# EAGLE design DisplayAddOn_V012 (EAGLE 9.1.0)
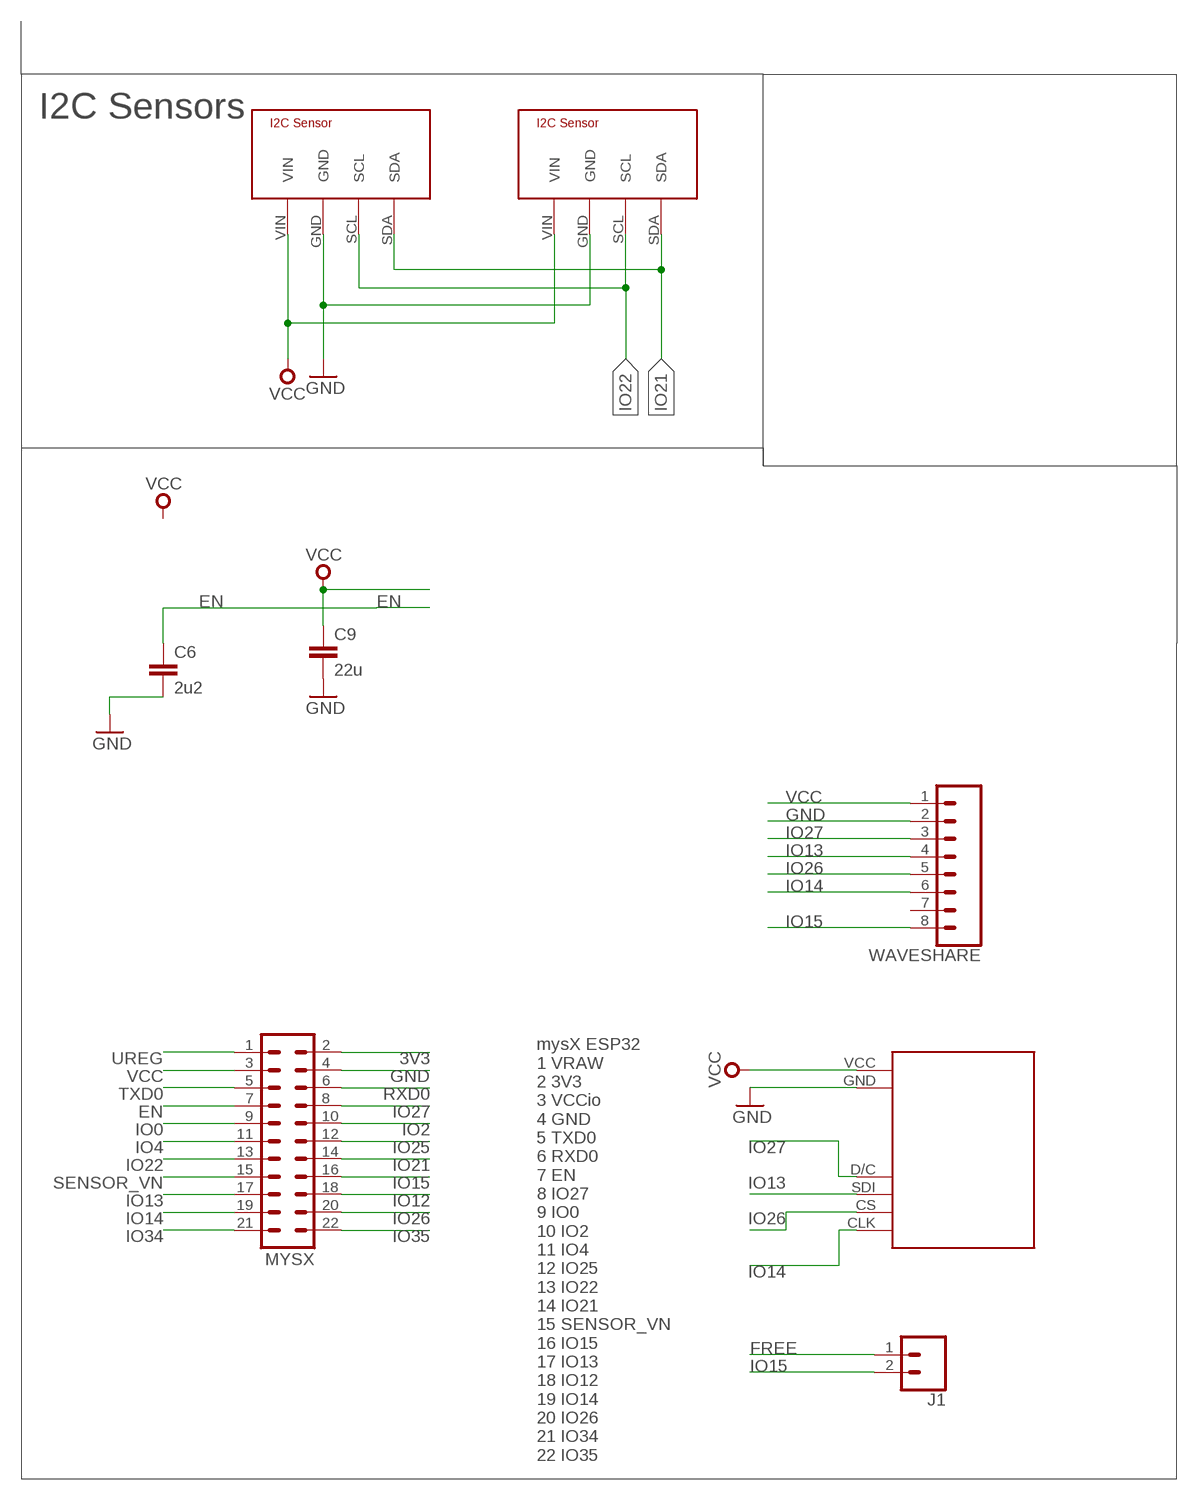
[diagram p0: schematic, sheet 1]

## Parts
C6  2u2  C-EUC0805  [C0805]
C9  22u  C-EUC0805  [C0805]
HELTEK  HELTEC_1.54STANDARD1  [HELTEC_1.54INCH]
J1  CONN_02  [1X02]
MYSX  MA11-2  [MA11-2]
U$2  I2C-BREAKOUT  [I2C_BREAKOUT]
U$4  I2C-BREAKOUT  [I2C_BREAKOUT]
WAVESHARE  CONN_08"  [1X08]

## Nets
3V3: MYSX.2
EN: C6.1 MYSX.7
FREE: J1.1
GND [gnd]: C6.2 C9.2 HELTEK.GND MYSX.4 U$2.GND U$4.GND WAVESHARE.2
IO0: MYSX.9
IO2: MYSX.10
IO4: MYSX.11
IO12: MYSX.18
IO13: HELTEK.SDI MYSX.17 WAVESHARE.4
IO14: HELTEK.CLK MYSX.19 WAVESHARE.6
IO15: J1.2 MYSX.16 WAVESHARE.8
IO21: MYSX.14 U$2.SDA U$4.SDA
IO22: MYSX.13 U$2.SCL U$4.SCL
IO25: MYSX.12
IO26: HELTEK.CS MYSX.20 WAVESHARE.5
IO27: HELTEK.D/C MYSX.8 WAVESHARE.3
IO34: MYSX.21
IO35: MYSX.22
RXD0: MYSX.6
SENSOR_VN: MYSX.15
TXD0: MYSX.5
UREG [gnd]: MYSX.1
VCC [gnd]: C9.1 HELTEK.VCC MYSX.3 U$2.VIN U$4.VIN WAVESHARE.1
Unconnected: WAVESHARE.7

## Notes on the sheet
- I2C Sensors
- mysX ESP32
  1 VRAW
  2 3V3
  3 VCCio
  4 GND
  5 TXD0
  6 RXD0
  7 EN
  8 IO27
  9 IO0
  10 IO2
  11 IO4
  12 IO25
  13 IO22
  14 IO21
  15 SENSOR_VN
  16 IO15
  17 IO13
  18 IO12
  19 IO14
  20 IO26
  21 IO34
  22 IO35

## Library data of the parts
C6 C9 = rcl@1:C-EU: CAPACITOR, European symbol; SPICEPREFIX: C
HELTEK = display_v2:HELTEC_1.54
J1 = SparkFun-Connectors:CONN_02: Multi connection point. Often used as Generic Header-pin footprint for 0.1 inch spaced/style header connections On any of the 0.1 inch spaced packages, you can populate with these: Break Away Headers - Straight <https://www.sparkfun.com/products/116> (PRT-00116) Break Away Male Headers - Right Angle <https://www.sparkfun.com/products/553> (PRT-00553) Female Headers <https://www.sparkfun.com/products/115> (PRT-00115) Break Away Headers - Machine Pin <https://www.sparkfun.com/products/117> (PRT-00117) Break Away Female Headers - Swiss Machine Pin <https://www.sparkfun.com/products/743> (PRT-00743) For SCREWTERMINALS and SPRING TERMINALS visit here: Screw Terimnals on SparkFun.com <https://www.sparkfun.com/search/results?term=Screw+Terminals> (5mm/3.5mm/2.54mm spacing) This device is also useful as a general connection point to wire up your design to another part of your project. Our various solder wires solder well into these plated through hole pads. Hook-Up Wire - Assortment (Stranded, 22 AWG) <https://www.sparkfun.com/products/11375> (PRT-11375) Hook-Up Wire - Assortment (Solid Core, 22 AWG) <https://www.sparkfun.com/products/11367> (PRT-11367) View the entire wire category on our website here <https://www.sparkfun.com/categories/141> Special notes: Molex polarized connector foot print use with: PRT-08233 with associated crimp pins and housings. 2.54_SCREWTERM for use with PRT-10571. 3.5mm Screw Terminal footprints for PRT-08084 5mm Screw Terminal footprints for use with PRT-08432
MYSX = con-Pinheader:MA11-2: PIN HEADER; OC_FARNELL: unknown; OC_NEWARK: unknown
U$2 U$4 = i2c:I2C-BREAKOUT
WAVESHARE = SparkFun-Connectors:CONN_08: Multi connection point. Often used as Generic Header-pin footprint for 0.1 inch spaced/style header connections On any of the 0.1 inch spaced packages, you can populate with these: Break Away Headers - Straight <https://www.sparkfun.com/products/116> (PRT-00116) Break Away Male Headers - Right Angle <https://www.sparkfun.com/products/553> (PRT-00553) Female Headers <https://www.sparkfun.com/products/115> (PRT-00115) Break Away Headers - Machine Pin <https://www.sparkfun.com/products/117> (PRT-00117) Break Away Female Headers - Swiss Machine Pin <https://www.sparkfun.com/products/743> (PRT-00743) Arduino Stackable Header - 8 Pin <https://www.sparkfun.com/products/9279> (PRT-09279) For SCREWTERMINALS and SPRING TERMINALS visit here: Screw Terimnals on SparkFun.com <https://www.sparkfun.com/search/results?term=Screw+Terminals> (5mm/3.5mm/2.54mm spacing) This device is also useful as a general connection point to wire up your design to another part of your project. Our various solder wires solder well into these plated through hole pads. Hook-Up Wire - Assortment (Stranded, 22 AWG) <https://www.sparkfun.com/products/11375> (PRT-11375) Hook-Up Wire - Assortment (Solid Core, 22 AWG) <https://www.sparkfun.com/products/11367> (PRT-11367) View the entire wire category on our website here <https://www.sparkfun.com/categories/141> Special notes: Molex polarized connector foot print use with SKU : PRT-08231 with associated crimp pins and housings. 1MM SMD Version SKU: PRT-10208 NOTES ON THE VARIANTS LOCK and LOCK_LONGPADS... This footprint was designed to help hold the alignment of a through-hole component (i.e. 6-pin header) while soldering it into place. You may notice that each hole has been shifted either up or down by 0.005 of an inch from it's more standard position (which is a perfectly straight line). This slight alteration caused the pins (the squares in the middle) to touch the edges of the holes. Because they are alternating, it causes a "brace" to hold the component in place. 0.005 has proven to be the perfect amount of "off-center" position when using our standard breakaway headers. Although looks a little odd when you look at the bare footprint, once you have a header in there, the alteration is very hard to notice. Also,if you push a header all the way into place, it is covered up entirely on the bottom side.; PROD_ID: CONN-08438

## Net classes
0 default: width 0.406 mm, clearance 0.205 mm
1 gnd: width 0.61 mm, drill 0.635 mm, clearance 0.254 mm
2 vcc: width 0.813 mm, drill 0.406 mm, clearance 0.254 mm

## Board
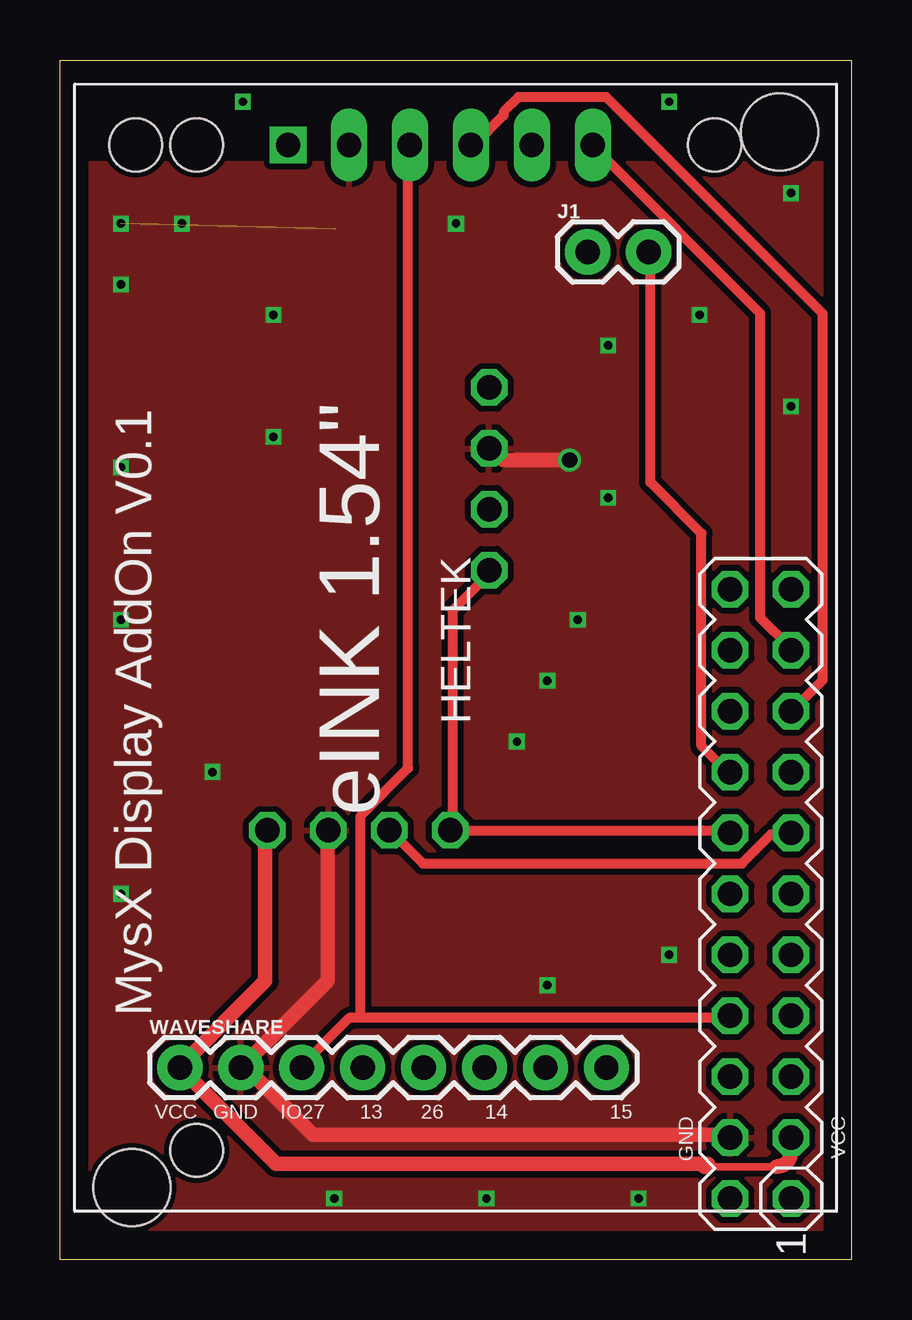
[diagram p1: board, top side]
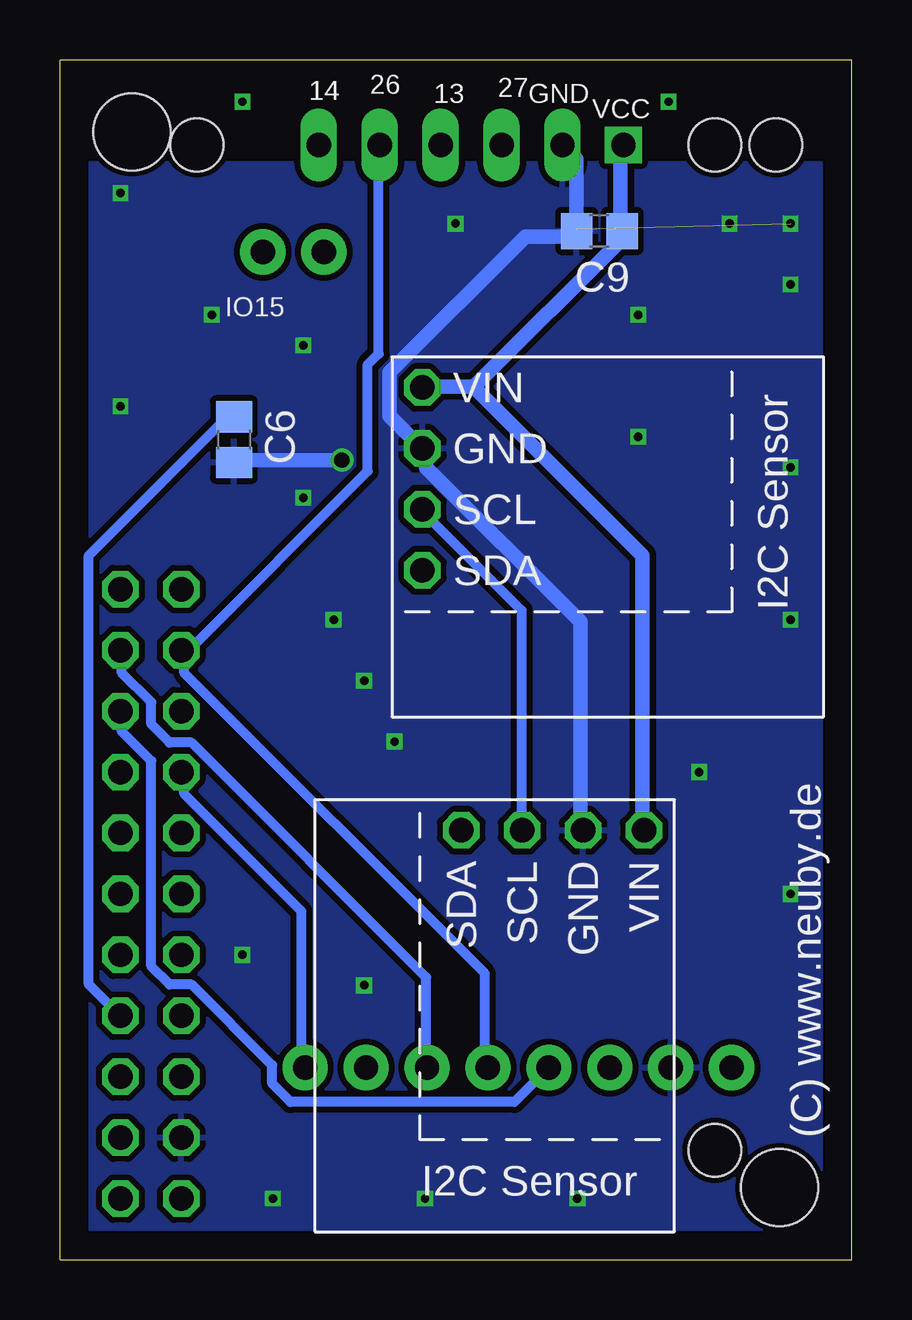
[diagram p2: board, bottom side, seen from below]

Size 33 x 50 mm. Coordinates in mm from the lower left corner, seen from the top.
Outline: 0,0 0,50 33,50 33,0 0,0
Copper layers (1*16): Top 0.035mm / dielectric 1.5mm / Bottom 0.035mm
Design rules "dirt_cheap_dirty_boards.v1": minimum track width 5mil, minimum drill 12mil, track to track 5mil, track to pad 5mil, pad to pad 5mil, via to via 5mil, smd to smd 0mil, copper to edge 10mil, drill to drill 10mil, minimum pad ring 10mil, minimum via ring 6mil, stop-mask expansion 2mil, vias tented up to drill 25mil, thermal gap 10mil
Holes 3.2 mm at 3,3 30,47
tRestrict: area 32,0 to 33,50; area 0,49 to 32,50
bRestrict: area 32,0 to 33,50; area 0,49 to 32,50

### Footprints (pad centres in the part's own frame; a part is rotated, then mirrored left to right if it is on the bottom)
C0805 = smd 1.3 x 1.5: 1 -0.95,0; 2 0.95,0
HELTEC_1.54INCH = drill 1.016 long: CLK 21.59,-7.62; CS 21.59,-5.08; D/C 21.59,0; GND 21.59,2.54; SDI 21.59,-2.54 | drill 1.016 square: VCC 21.59,5.08 | hole 2.2: 21.59,11.43; 21.59,8.89; 21.59,-12.7; -20.32,8.89
1X02 = drill 1.016 pad 1.88: 1 0,0; 2 2.54,0
MA11-2 = drill 1.016 octagon: 1 -12.7,-1.27; 2 -12.7,1.27; 3 -10.16,-1.27; 4 -10.16,1.27; 5 -7.62,-1.27; 6 -7.62,1.27; 7 -5.08,-1.27; 8 -5.08,1.27; 9 -2.54,-1.27; 10 -2.54,1.27; 11 0,-1.27; 12 0,1.27; 13 2.54,-1.27; 14 2.54,1.27; 15 5.08,-1.27; 16 5.08,1.27; 17 7.62,-1.27; 18 7.62,1.27; 19 10.16,-1.27; 20 10.16,1.27; 21 12.7,-1.27; 22 12.7,1.27
I2C_BREAKOUT = drill 1.016 octagon: GND -3.81,-8.89; SCL -1.27,-8.89; SDA 1.27,-8.89; VIN -6.35,-8.89
1X08 = drill 1.016 pad 1.88: 1 0,0; 2 2.54,0; 3 5.08,0; 4 7.62,0; 5 10.16,0; 6 12.7,0; 7 15.24,0; 8 17.78,0

### Placement (x,y rotation side)
C6  25.74,34.17 270 bottom
C9  10.51,42.87 180 bottom
HELTEK  14.59,24.87 90 top
J1  22,42 0 top
MYSX  29.21,15.24 90 top
U$2  9,30 270 bottom
U$4  15,9 180 bottom
WAVESHARE  5,8 0 top

### Tracks (layer width: path | path; a pad name or v marks a point on that pad's centre or on a via)
EN
  Bottom 0.406: C6.1 25.83,35 26.14,35 31.79,29.35 31.79,11.46 30.57,10.24 MYSX.7
GND  (via drill 0.35, 0.64)  (1 unrouted)
  Top 0.61: v21.25,33.32 18.5,33.32 18.04,33.78 U$2.GND | U$4.GND 11.16,17.88 11.16,11.62 7.64,8.1 WAVESHARE.2 7.79,7.95 10.55,5.2 27.82,5.2 MYSX.4
  Bottom 0.61: HELTEK.GND 11.92,46.31 11.46,45.85 11.46,42.95 C9.2 11.62,42.65 13.6,42.65 19.26,36.99 19.26,35.16 18.04,33.93 U$2.GND 17.73,33.63 17.73,33.02 11.31,26.6 11.31,18.04 U$4.GND | v21.25,33.32 25.68,33.32 C6.2
  other vias: 2.54,43.18 2.54,40.64 5.08,43.18 16.51,43.18 30.48,44.45 30.48,35.56 22.86,31.75 21.59,26.67 20.32,24.13 19.05,21.59 2.54,33.02 2.54,26.67 2.54,15.24 11.43,2.54 17.78,2.54 25.4,12.7 20.32,11.43 6.35,20.32 8.89,34.29 8.89,39.37 26.67,39.37 22.86,38.1 25.4,48.26 7.62,48.26 24.13,2.54
  pour Top: 1.27,45.72 31.75,45.72 31.75,1.27 1.27,1.27
  pour Bottom: 1.27,45.72 31.75,45.72 31.75,1.27 1.27,1.27
IO13
  Top 0.406: HELTEK.SDI 17.27,46.47 18.5,47.69 18.5,47.84 19.11,48.45 22.77,48.45 31.79,39.44 31.79,24.15 30.57,22.93 MYSX.17
  Bottom 0.406: MYSX.17 30.42,22.77 30.42,22.01 29.19,20.79 29.19,12.23 28.43,11.46 27.51,11.46 24.15,8.1 24.15,7.34 23.39,6.57 14.06,6.57 12.69,7.95 WAVESHARE.4
IO14
  Top 0.406: HELTEK.CLK 22.32,46.31 29.19,39.44 29.19,26.75 30.42,25.53 MYSX.19
  Bottom 0.406: MYSX.19 30.42,25.37 30.42,24.46 29.19,23.23 29.19,22.32 28.43,21.55 27.51,21.55 17.73,11.77 17.73,8.1 WAVESHARE.6
IO15
  Top 0.406: J1.2 24.61,41.88 24.61,32.4 26.75,30.26 26.75,21.4 27.82,20.33 MYSX.16
  Bottom 0.406: MYSX.16 27.82,20.18 27.82,19.41 22.93,14.52 22.93,8.1 WAVESHARE.8
IO21
  Top 0.406: U$2.SDA 17.88,28.58 16.36,27.05 16.36,18.04 U$4.SDA 16.36,17.88 27.82,17.88 MYSX.14
IO22
  Top 0.406: MYSX.13 30.42,17.73 29.65,17.73 28.43,16.51 15.13,16.51 13.76,17.88 U$4.SCL
  Bottom 0.406: U$4.SCL 13.76,18.04 13.76,27.05 17.88,31.18 U$2.SCL
IO26
  Bottom 0.406: WAVESHARE.5 15.29,8.1 15.29,11.92 27.82,24.46 27.82,25.37 MYSX.20 27.67,25.37 20.18,32.86 20.18,37.3 19.72,37.75 19.72,46.31 HELTEK.CS
IO27
  Top 0.406: 12.53,10.09 12.07,10.09 10.09,8.1 WAVESHARE.3 | 12.53,10.09 27.82,10.09 MYSX.8 | HELTEK.D/C 14.52,46.31 14.52,20.48 12.53,18.5 12.53,10.24 12.53,10.09
VCC
  Top 0.305: 26.87,3.87 29.87,3.87
  Top 0.61: U$4.VIN 8.56,17.88 8.56,11.62 5.04,8.1 WAVESHARE.1 9,4 27,4 arc90 26.87,3.87 | 29.87,3.87 arc90 30.48,4.48 MYSX.3
  Bottom 0.61: HELTEK.VCC 9.63,46.31 9.63,42.95 C9.1 9.48,42.65 15.74,36.38 | 15.74,36.38 17.88,36.38 U$2.VIN | U$4.VIN 8.71,18.04 8.71,29.35 15.59,36.23 15.74,36.38

### Text on the board
tNames: MysX Display AddOn V0.1 | VCC | GND | IO27 | 13 | 26 | 14 | 15 | GND | VCC
bNames: GND | 27 | 13 | 26 | 14 | VCC | IO15 | (C) www.neuby.de
Document: DS_1551K